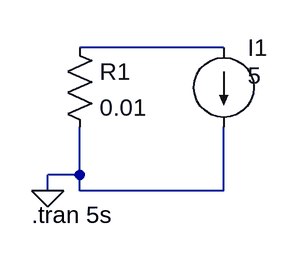
[diagram p0: schematic shunt-analysis.asc]
shunt-analysis.asc, the LTspice schematic file:
Version 4.1
SHEET 1 880 680
WIRE 160 112 16 112
WIRE 16 240 16 192
WIRE 16 240 -16 240
WIRE -16 256 -16 240
WIRE 16 256 16 240
WIRE 160 256 160 192
WIRE 160 256 16 256
FLAG -16 256 0
SYMBOL current 160 112 R0
WINDOW 3 24 28 Left 2
WINDOW 123 0 0 Left 0
WINDOW 39 0 0 Left 0
SYMATTR InstName I1
SYMATTR Value 5
SYMBOL res 0 96 R0
SYMATTR InstName R1
SYMATTR Value 0.01
TEXT -32 280 Left 2 !.tran 5s

The netlist it stands for:
* shunt-analysis.asc
I1 N001 0 5
R1 N001 0 0.01
.tran 5s
.backanno
.end